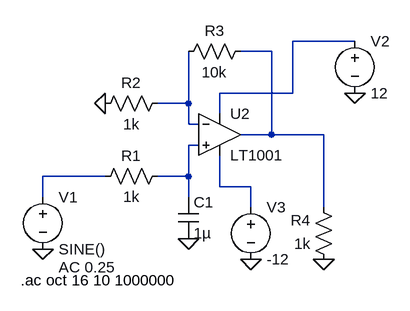
[diagram p0: schematic D2-DÇ1.asc]
D2-DÇ1.asc, the LTspice schematic file:
Version 4
SHEET 1 880 680
WIRE 576 -128 480 -128
WIRE 448 -112 400 -112
WIRE 480 -48 480 -128
WIRE 480 -48 368 -48
WIRE 320 -32 320 -112
WIRE 320 -32 272 -32
WIRE 368 -16 368 -48
WIRE 320 0 320 -32
WIRE 336 0 320 0
WIRE 448 16 448 -112
WIRE 448 16 400 16
WIRE 528 16 448 16
WIRE 336 32 320 32
WIRE 192 80 96 80
WIRE 320 80 320 32
WIRE 320 80 272 80
WIRE 368 96 368 48
WIRE 416 96 368 96
WIRE 96 112 96 80
WIRE 320 112 320 80
WIRE 416 128 416 96
WIRE 528 128 528 16
FLAG 96 192 0
FLAG 416 208 0
FLAG 576 -48 0
FLAG 320 176 0
FLAG 192 -32 0
FLAG 528 208 0
SYMBOL voltage 96 96 R0
WINDOW 123 24 124 Left 2
WINDOW 39 0 0 Left 0
SYMATTR InstName V1
SYMATTR Value SINE()
SYMATTR Value2 AC 0.25
SYMBOL res 288 64 R90
WINDOW 0 0 56 VBottom 2
WINDOW 3 32 56 VTop 2
SYMATTR InstName R1
SYMATTR Value 1k
SYMBOL res 288 -48 R90
WINDOW 0 0 56 VBottom 2
WINDOW 3 32 56 VTop 2
SYMATTR InstName R2
SYMATTR Value 1k
SYMBOL res 416 -128 R90
WINDOW 0 0 56 VBottom 2
WINDOW 3 32 56 VTop 2
SYMATTR InstName R3
SYMATTR Value 10k
SYMBOL res 544 224 R180
WINDOW 0 36 76 Left 2
WINDOW 3 36 40 Left 2
SYMATTR InstName R4
SYMATTR Value 1k
SYMBOL OpAmps\\LT1001 368 -48 R0
SYMATTR InstName U2
SYMBOL voltage 576 -144 R0
WINDOW 123 0 0 Left 0
WINDOW 39 0 0 Left 0
SYMATTR InstName V2
SYMATTR Value 12
SYMBOL voltage 416 112 R0
WINDOW 123 0 0 Left 0
WINDOW 39 0 0 Left 0
SYMATTR InstName V3
SYMATTR Value -12
SYMBOL cap 304 112 R0
SYMATTR InstName C1
SYMATTR Value 1µ
TEXT 62 240 Left 2 !.ac oct 16 10 1000000

The netlist it stands for:
* D2-DÇ1.asc
V1 N005 0 SINE() AC 0.25
R1 N004 N005 1k
R2 N003 0 1k
R3 N002 N003 10k
R4 0 N002 1k
XU2 N004 N003 N001 N006 N002 LT1001  ; pins In+ In- V+ V- OUT
V2 N001 0 12
V3 N006 0 -12
C1 N004 0 1µ
.ac oct 16 10 1000000
.lib LTC.lib
.backanno
.end